# EAGLE design NeoJointV2A-000-12mm (EAGLE 6.6.0)
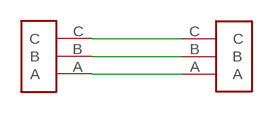
[diagram p0: schematic, sheet 1]

## Parts
U$1  LED_STRIP_3P  [LEDSTRIP-3P]
U$2  LED_STRIP_3P  [LEDSTRIP-3P]

## Nets
A: U$1.A U$2.A
B: U$1.B U$2.B
C: U$1.C U$2.C

## Library data of the parts
U$1 U$2 = todstuff:LED_STRIP_3P

## Board
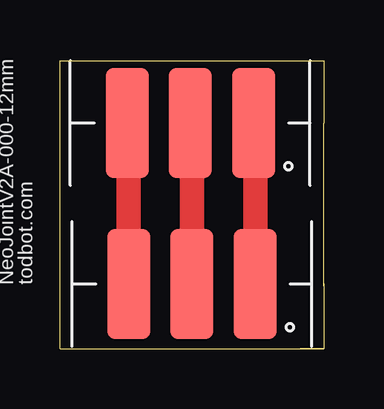
[diagram p1: board, top side]

Size 11 x 12 mm. Coordinates in mm from the lower left corner, seen from the top.
Outline: 10.03,0 0,0 0,12 11,12 11,9.4 11,2.6
Outline: 10.03,0 11,0
Outline: 11,0 10.03,0
Outline: 11,2.7 11,2.6
Outline: 11,2.6 11,0
Copper layers (1*16): Top 0.0356mm / dielectric 1.5011mm / Bottom 0.0356mm
Design rules "LaenPCBOrder-tod": minimum track width 10mil, minimum drill 13mil, track to track 6mil, track to pad 8mil, pad to pad 8mil, via to via 8mil, smd to smd 6mil, copper to edge 15mil, drill to drill 8mil, minimum pad ring 7mil, minimum via ring 7mil, stop-mask expansion 4mil, vias tented up to drill 25mil, thermal gap 10mil

### Footprints (pad centres in the part's own frame; a part is rotated, then mirrored left to right if it is on the bottom)
LEDSTRIP-3P = smd 4.6 x 1.8: A 0,-2.65; B 0,0; C 0,2.63

### Placement (x,y rotation side)
U$1  5.5,2.7 90 top
U$2  5.44,9.41 90 top

### Tracks (layer width: path | path; a pad name or v marks a point on that pad's centre or on a via)
A
  Top 1.016: U$2.A arc-90 8.15,9.34 U$1.A
B
  Top 1.016: U$2.B arc-90 5.5,9.34 U$1.B
C
  Top 1.016: U$2.C arc-90 2.87,9.34 U$1.C

### Text on the board
tPlace: NeoJointV2A-000-12mm | todbot.com